# Altium project VENTUNOQ.PrjPcb (part 16 of 18)

## Sheet WIFI_BLE.SchDoc: WIFI BLE
size A3; Author: Silvio Navaretti; CompanyName: ARDUINO; DrawnBy: Silvio Navaretti; Engineer: Silvio Navaretti; Organization: ARDUINO; SheetNumber: 29; SheetTotal: 51; RevAuthor: Silvio Navaretti
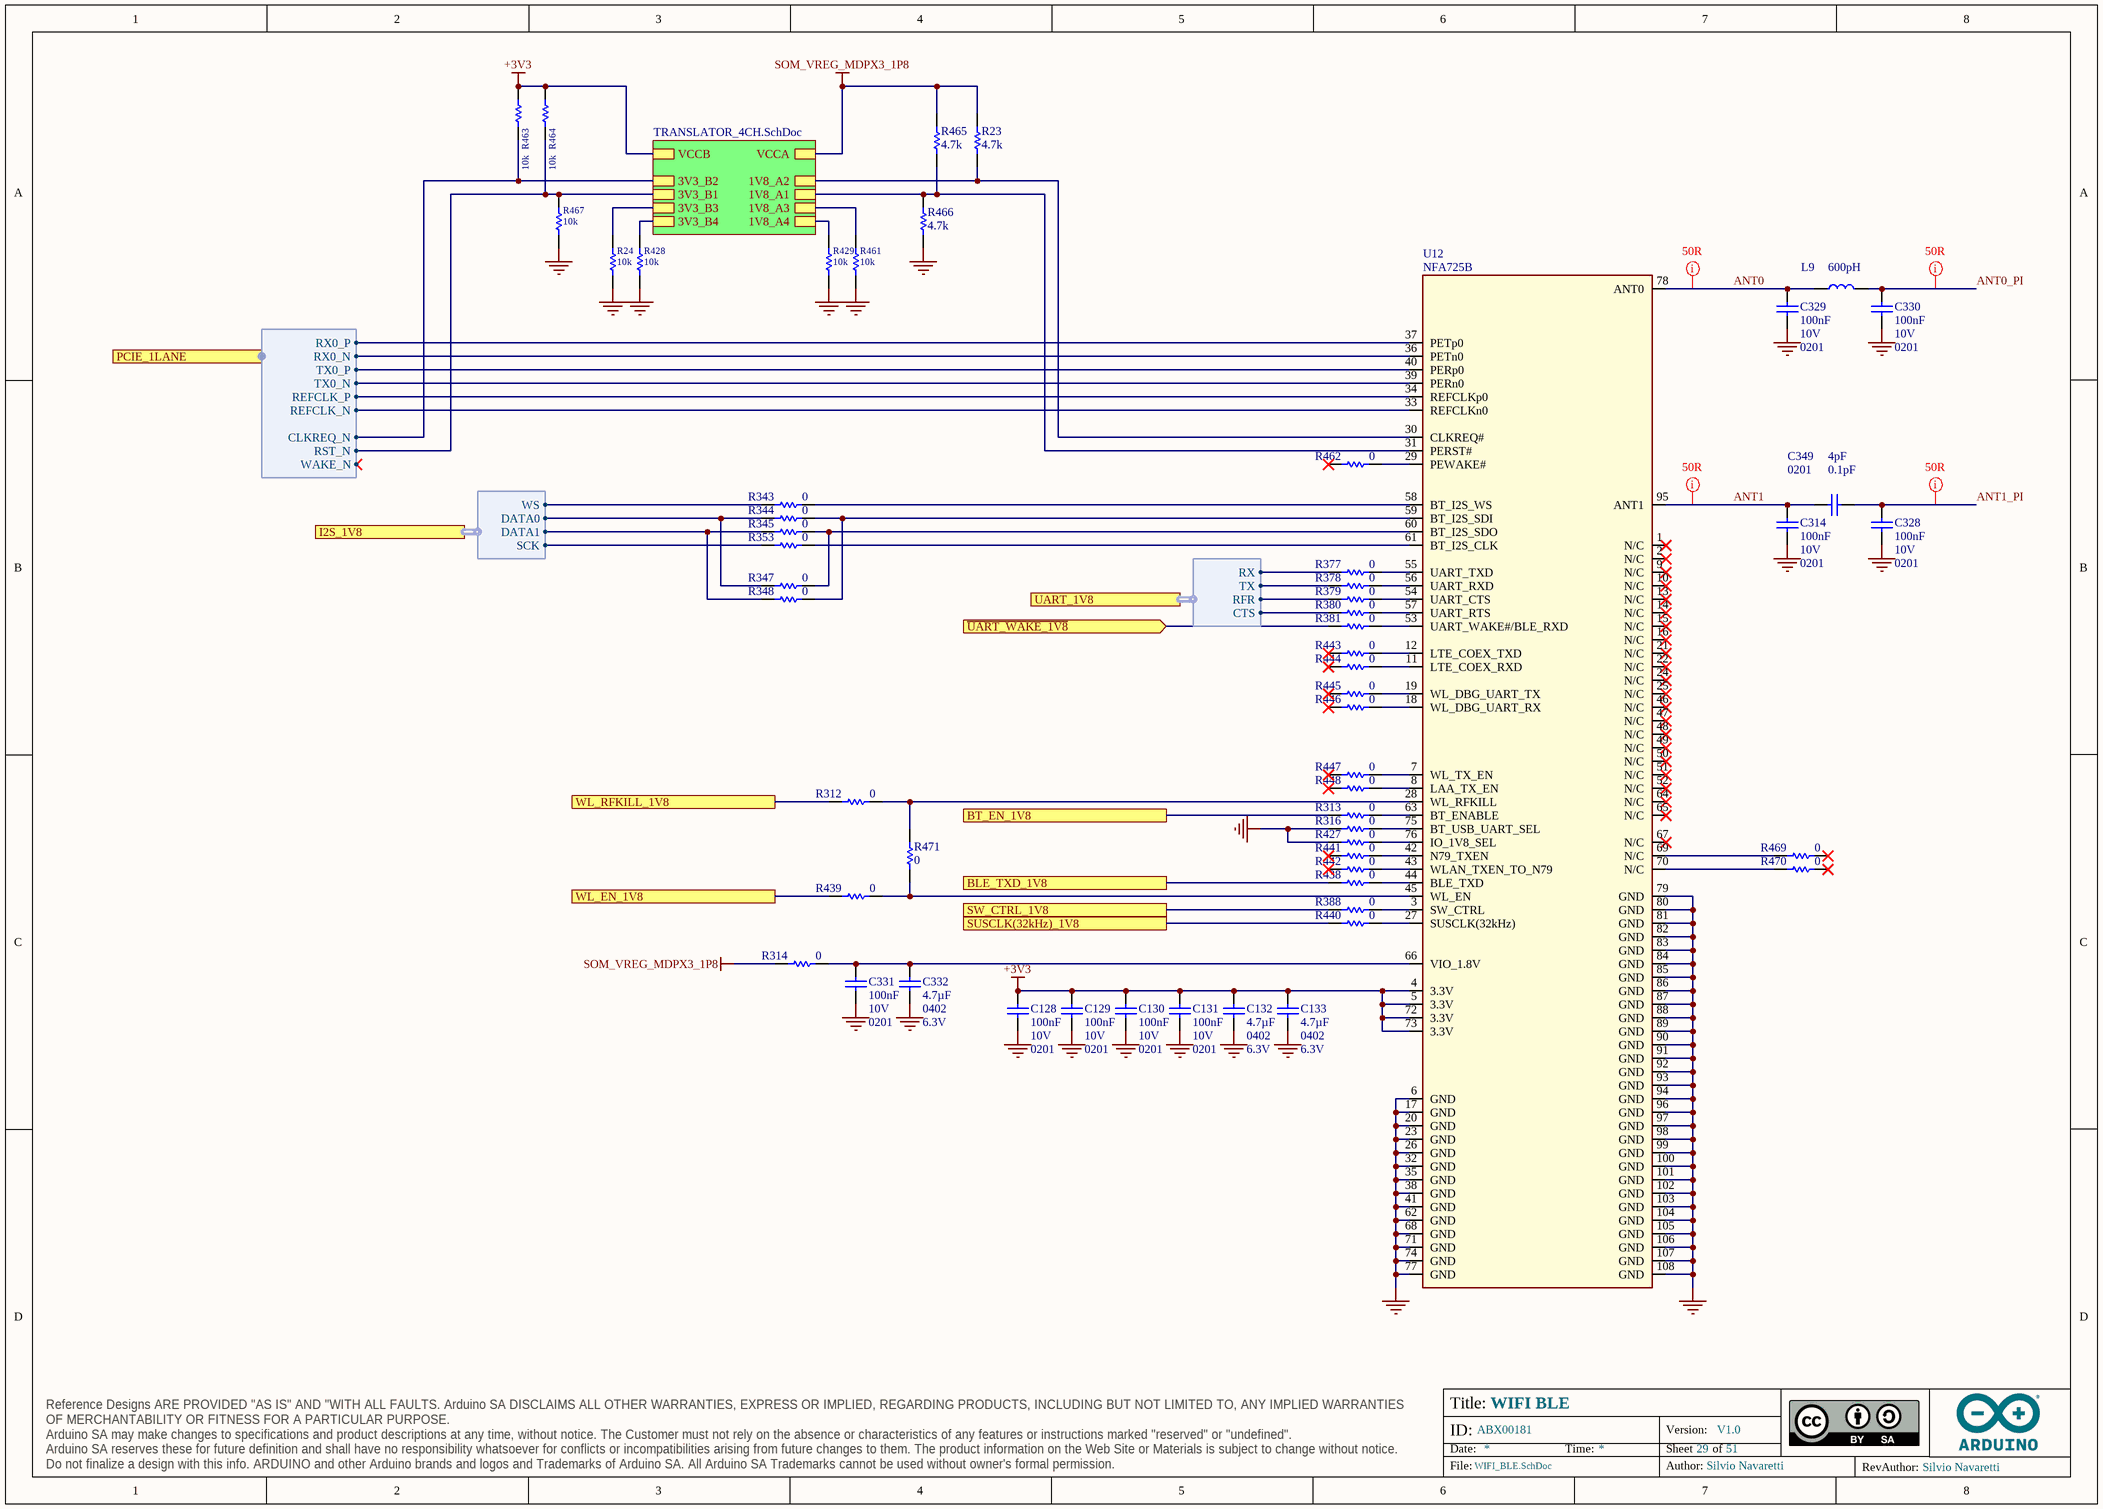
[diagram p49: WIFI_BLE.SchDoc]

### Parts
C128  value 100nF  Voltage: 10V  Case Code (Imperial): 0201  [CAP-0201]  (hidden comment: CL03A104KP3NNNC)
C129  value 100nF  Voltage: 10V  Case Code (Imperial): 0201  [CAP-0201]  (hidden comment: CL03A104KP3NNNC)
C130  value 100nF  Voltage: 10V  Case Code (Imperial): 0201  [CAP-0201]  (hidden comment: CL03A104KP3NNNC)
C131  value 100nF  Voltage: 10V  Case Code (Imperial): 0201  [CAP-0201]  (hidden comment: CL03A104KP3NNNC)
C132  value 4.7µF  Case Code (Imperial): 0402  Voltage: 6.3V  [CAP-0402]  (hidden comment: C1005A475M6R3NT)
C133  value 4.7µF  Case Code (Imperial): 0402  Voltage: 6.3V  [CAP-0402]  (hidden comment: C1005A475M6R3NT)
C314  value 100nF  Voltage: 10V  Case Code (Imperial): 0201  [CAP-0201]  (hidden comment: CL03A104KP3NNNC)
C328  value 100nF  Voltage: 10V  Case Code (Imperial): 0201  [CAP-0201]  (hidden comment: CL03A104KP3NNNC)
C329  value 100nF  Voltage: 10V  Case Code (Imperial): 0201  [CAP-0201]  (hidden comment: CL03A104KP3NNNC)
C330  value 100nF  Voltage: 10V  Case Code (Imperial): 0201  [CAP-0201]  (hidden comment: CL03A104KP3NNNC)
C331  value 100nF  Voltage: 10V  Case Code (Imperial): 0201  [CAP-0201]  (hidden comment: CL03A104KP3NNNC)
C332  value 4.7µF  Case Code (Imperial): 0402  Voltage: 6.3V  [CAP-0402]  (hidden comment: C1005A475M6R3NT)
C349  value 4pF  Case Code (Imperial): 0201  Tolerance: 0.1pF  [CAP-0201]  (hidden comment: GRM0335C1H4R0BA01D)
L9  Inductance: 600pH  [0201DS Coilcraft]  (hidden comment: 0201DS-0N6XKEW)
R23  value 4.7k  [RES-0201]  (hidden comment: RC0201FR-074K7L)
R24  value 10k  [RES-0201]  (hidden comment: RC0201FR-0710KL)
R312  value 0  [RES-0201]  (hidden comment: CRCW02010000Z0ED)
R313  value 0  [RES-0201]  (hidden comment: CRCW02010000Z0ED)
R314  value 0  [RES-0201]  (hidden comment: CRCW02010000Z0ED)
R316  value 0  [RES-0201]  (hidden comment: CRCW02010000Z0ED)
R343  value 0  [RES-0201]  (hidden comment: CRCW02010000Z0ED)
R344  value 0  [RES-0201]  (hidden comment: CRCW02010000Z0ED)
R345  value 0  [RES-0201]  (hidden comment: CRCW02010000Z0ED)
R347  value 0  [RES-0201]  (hidden comment: CRCW02010000Z0ED)
R348  value 0  [RES-0201]  (hidden comment: CRCW02010000Z0ED)
R353  value 0  [RES-0201]  (hidden comment: CRCW02010000Z0ED)
R377  value 0  [RES-0201]  (hidden comment: CRCW02010000Z0ED)
R378  value 0  [RES-0201]  (hidden comment: CRCW02010000Z0ED)
R379  value 0  [RES-0201]  (hidden comment: CRCW02010000Z0ED)
R380  value 0  [RES-0201]  (hidden comment: CRCW02010000Z0ED)
R381  value 0  [RES-0201]  (hidden comment: CRCW02010000Z0ED)
R388  value 0  [RES-0201]  (hidden comment: CRCW02010000Z0ED)
R427  value 0  [RES-0201]  (hidden comment: CRCW02010000Z0ED)
R428  value 10k  [RES-0201]  (hidden comment: RC0201FR-0710KL)
R429  value 10k  [RES-0201]  (hidden comment: RC0201FR-0710KL)
R438  value 0  [RES-0201]  (hidden comment: CRCW02010000Z0ED)
R439  value 0  [RES-0201]  (hidden comment: CRCW02010000Z0ED)
R440  value 0  [RES-0201]  (hidden comment: CRCW02010000Z0ED)
R441  value 0  [RES-0201]  (hidden comment: CRCW02010000Z0ED)
R442  value 0  [RES-0201]  (hidden comment: CRCW02010000Z0ED)
R443  value 0  [RES-0201]  (hidden comment: CRCW02010000Z0ED)
R444  value 0  [RES-0201]  (hidden comment: CRCW02010000Z0ED)
R445  value 0  [RES-0201]  (hidden comment: CRCW02010000Z0ED)
R446  value 0  [RES-0201]  (hidden comment: CRCW02010000Z0ED)
R447  value 0  [RES-0201]  (hidden comment: CRCW02010000Z0ED)
R448  value 0  [RES-0201]  (hidden comment: CRCW02010000Z0ED)
R461  value 10k  [RES-0201]  (hidden comment: RC0201FR-0710KL)
R462  value 0  [RES-0201]  (hidden comment: CRCW02010000Z0ED)
R463  value 10k  [RES-0201]  (hidden comment: RC0201FR-0710KL)
R464  value 10k  [RES-0201]  (hidden comment: RC0201FR-0710KL)
R465  value 4.7k  [RES-0201]  (hidden comment: RC0201FR-074K7L)
R466  value 4.7k  [RES-0201]  (hidden comment: RC0201FR-074K7L)
R467  value 10k  [RES-0201]  (hidden comment: RC0201FR-0710KL)
R469  value 0  [RES-0201]  (hidden comment: CRCW02010000Z0ED)
R470  value 0  [RES-0201]  (hidden comment: CRCW02010000Z0ED)
R471  value 0  [RES-0201]  (hidden comment: CRCW02010000Z0ED)
U12  NFA725B  [NFA725B]

### Sub-sheets
U_TRANSLATOR_4CH = TRANSLATOR_4CH.SchDoc: 1V8_A1, 1V8_A2, 1V8_A3, 1V8_A4, 3V3_B1, 3V3_B2, 3V3_B3, 3V3_B4, VCCA, VCCB

### Ports
BLE_TXD_1V8, BT_EN_1V8, I2S_1V8 (harness SOM_MD_I2S), PCIE_1LANE (harness PCIE_1LANE), SUSCLK(32kHz)_1V8, SW_CTRL_1V8, UART_1V8 (harness SOM_MD_UART_FLCRTL), WL_EN_1V8, WL_RFKILL_1V8, ~{UART_WAKE_1V8} (in)

### Harnesses
SOM_MD_I2S: SCK, WS, DATA0, DATA1
SOM_MD_UART_FLCRTL: TX, CTS, RFR, RX
PCIE_1LANE: RX0_N, RX0_P, TX0_P, TX0_N, REFCLK_N, REFCLK_P, WAKE_N, CLKREQ_N, RST_N

### Nets
+3V3: C128.2 C129.2 C130.2 C131.2 C132.1 C133.1 R463.1 R464.1 U12.4(3.3V) U12.5(3.3V) U12.72(3.3V) U12.73(3.3V) ; sheet U_TRANSLATOR_4CH/VCCB
GND: C128.1 C129.1 C130.1 C131.1 C132.2 C133.2 C314.1 C328.1 C329.1 C330.1 C331.1 C332.2 R24.1 R316.1 R427.1 R428.1 R429.1 R461.1 R466.1 R467.1 U12.6(GND) U12.17(GND) U12.20(GND) U12.23(GND) U12.26(GND) U12.32(GND) U12.35(GND) U12.38(GND) U12.41(GND) U12.62(GND) U12.68(GND) U12.71(GND) U12.74(GND) U12.77(GND) U12.79(GND) U12.80(GND) U12.81(GND) U12.82(GND) U12.83(GND) U12.84(GND) U12.85(GND) U12.86(GND) U12.87(GND) U12.88(GND) U12.89(GND) U12.90(GND) U12.91(GND) U12.92(GND) U12.93(GND) U12.94(GND) U12.96(GND) U12.97(GND) U12.98(GND) U12.99(GND) U12.100(GND) U12.101(GND) U12.102(GND) U12.103(GND) U12.104(GND) U12.105(GND) U12.106(GND) U12.107(GND) U12.108(GND)
SOM_VREG_MDPX3_1P8: R23.2 R314.1 R465.2 ; sheet U_TRANSLATOR_4CH/VCCA
ANT0: C329.2 L9.1 U12.78(ANT0)  [project net ANT0_29]
ANT0_PI: C330.2 L9.2  [project net ANT0_PI_29]
ANT1: C314.2 C349.2 U12.95(ANT1)  [project net ANT1_29]
ANT1_PI: C328.2 C349.1  [project net ANT1_PI_29]
CTS_1V8: R380.1 ; port UART_1V8.CTS
MD_GPIO_54: R312.1 ; port WL_RFKILL_1V8
MD_GPIO_55: R313.1 ; port BT_EN_1V8
MD_GPIO_56: R439.1 ; port WL_EN_1V8
MD_GPIO_65: R381.1 ; port ~{UART_WAKE_1V8}
MD_GPIO_85: R379.1 ; port UART_1V8.RFR
MD_GPIO_86: R378.1 ; port UART_1V8.TX
MD_GPIO_87: R377.1 ; port UART_1V8.RX
MD_GPIO_100: R388.1 ; port SW_CTRL_1V8
MD_GPIO_101: R438.1 ; port BLE_TXD_1V8
MD_LPASS_GPIO_129: R353.1 ; port I2S_1V8.SCK
MD_LPASS_GPIO_130: R343.1 ; port I2S_1V8.WS
MD_LPASS_GPIO_131: R344.1 R347.1 ; port I2S_1V8.DATA0
MD_LPASS_GPIO_132: R345.1 R348.1 ; port I2S_1V8.DATA1
PCIE1_REFCLK0_N: U12.33(REFCLKn0) ; port PCIE_1LANE.REFCLK_N
PCIE1_REFCLK0_P: U12.34(REFCLKp0) ; port PCIE_1LANE.REFCLK_P
PCIE1_RX0_N: U12.36(PETn0) ; port PCIE_1LANE.RX0_N
PCIE1_RX0_P: U12.37(PETp0) ; port PCIE_1LANE.RX0_P
PCIE1_TX0_CAP_N: U12.39(PERn0) ; port PCIE_1LANE.TX0_N
PCIE1_TX0_CAP_P: U12.40(PERp0) ; port PCIE_1LANE.TX0_P
SLEEP_CLK: R440.1 ; port SUSCLK(32kHz)_1V8
NetC331_2: C331.2 C332.1 R314.2 U12.66(VIO_1.8V)
NetR23_1: R23.1 U12.30(CLKREQ#) ; sheet U_TRANSLATOR_4CH/1V8_A2
NetR24_2: R24.2 ; sheet U_TRANSLATOR_4CH/3V3_B3
NetR312_2: R312.2 R471.1 U12.28(WL_RFKILL)
NetR313_2: R313.2 U12.63(BT_ENABLE)
NetR316_2: R316.2 U12.75(BT_USB_UART_SEL)
NetR343_2: R343.2 U12.58(BT_I2S_WS)
NetR344_2: R344.2 R348.2 U12.59(BT_I2S_SDI)
NetR345_2: R345.2 R347.2 U12.60(BT_I2S_SDO)
NetR353_2: R353.2 U12.61(BT_I2S_CLK)
NetR377_2: R377.2 U12.55(UART_TXD)
NetR378_2: R378.2 U12.56(UART_RXD)
NetR379_2: R379.2 U12.54(UART_CTS)
NetR380_2: R380.2 U12.57(UART_RTS)
NetR381_2: R381.2 U12.53(UART_WAKE#/BLE_RXD)
NetR388_2: R388.2 U12.3(SW_CTRL)
NetR427_2: R427.2 U12.76(IO_1V8_SEL)
NetR428_2: R428.2 ; sheet U_TRANSLATOR_4CH/3V3_B4
NetR429_2: R429.2 ; sheet U_TRANSLATOR_4CH/1V8_A4
NetR438_2: R438.2 U12.44(BLE_TXD)
NetR439_2: R439.2 R471.2 U12.45(WL_EN)
NetR440_2: R440.2 U12.27(SUSCLK(32kHz))
NetR441_2: R441.2 U12.42(N79_TXEN)
NetR442_2: R442.2 U12.43(WLAN_TXEN_TO_N79)
NetR443_2: R443.2 U12.12(LTE_COEX_TXD)
NetR444_2: R444.2 U12.11(LTE_COEX_RXD)
NetR445_2: R445.2 U12.19(WL_DBG_UART_TX)
NetR446_2: R446.2 U12.18(WL_DBG_UART_RX)
NetR447_2: R447.2 U12.7(WL_TX_EN)
NetR448_2: R448.2 U12.8(LAA_TX_EN)
NetR461_2: R461.2 ; sheet U_TRANSLATOR_4CH/1V8_A3
NetR462_2: R462.2 U12.29(PEWAKE#)
NetR463_2: R463.2 ; sheet U_TRANSLATOR_4CH/3V3_B2, port PCIE_1LANE.CLKREQ_N
NetR464_2: R464.2 R467.2 ; sheet U_TRANSLATOR_4CH/3V3_B1, port PCIE_1LANE.RST_N
NetR465_1: R465.1 R466.2 U12.31(PERST#) ; sheet U_TRANSLATOR_4CH/1V8_A1
NetR469_1: R469.1 U12.69(N/C)
NetR470_1: R470.1 U12.70(N/C)

Not connected (* = marked no-connect by the designer): R441 1*; R442 1*; R443 1*; R444 1*; R445 1*; R446 1*; R447 1*; R448 1*; R462 1*; R469 2*; R470 2*; U12 1(N/C)* 2(N/C)* 9(N/C)* 10(N/C)* 13(N/C)* 14(N/C)* 15(N/C)* 16(N/C)* 21(N/C)* 22(N/C)* 24(N/C)* 25(N/C)* 46(N/C)* 47(N/C)* 48(N/C)* 49(N/C)* 50(N/C)* 51(N/C)* 52(N/C)* 64(N/C)* 65(N/C)* 67(N/C)*

### Layout directives
net class 50R: ANT0_29, ANT0_PI_29, ANT1_29, ANT1_PI_29

### Notes on the sheet
- Title:
- ID:
- Date:
- Time:
- Version:
- Sheet
- of
- RevAuthor:
- Reference Designs ARE PROVIDED "AS IS" AND "WITH ALL FAULTS. Arduino SA DISCLAIMS ALL OTHER WARRANTIES, EXPRESS OR IMPLIED, REGARDING PRODUCTS, INCLUDING BUT NOT LIMITED TO, ANY IMPLIED WARRANTIES OF MERCHANTABILITY OR FITNESS FOR A PARTICULAR PURPOSE.
  Arduino SA may make changes to specifications and product descriptions at any time, without notice. The Customer must not rely on the absence or characteristics of any features or instructions marked "reserved" or "undefined".
  Arduino SA reserves these for future definition and shall have no responsibility whatsoever for conflicts or incompatibilities arising from future changes to them. The product information on the Web Site or Materials is subject to change without notice.
  Do not finalize a design with this info. ARDUINO and other Arduino brands and logos and Trademarks of Arduino SA. All Arduino SA Trademarks cannot be used without owner's formal permission.
- File:
- Author:

### Library data of the parts
C128-C131 C314 C328-C331 = C0113-A.6: CAP CHIP 0201 100nF 10% 10V X5R; Manufacturer: Samsung Electro-Mechanics; Code Arduino: C0113; Technology: Ceramic; Part Number: CL03A104KP3NNNC; Dielectric: X5R; Tolerance: 10%
C132 C133 C332 = C0037-A.14: CAP CHIP 0402 4.7uF 20% 6V3 X5R; Manufacturer: Hottech; Code Arduino: 0833; Dielectric: X5R; Technology: Ceramic; Part Number: C1005A475M6R3NT; Manufacturer 2: Samsung Electro-Mechanics; Tolerance: 20%; Manufacturer 3: Murata Electronics; Part number 3: GRM155R60J475ME47D; Part number 2: CL05A475KQ5NRNC
C349 = C0210-A.1: CAP CHIP 0201 4pF 0.1pF 50V C0G; Manufacturer: Murata; Code Arduino: C0210; Technology: Ceramic; Part Number: GRM0335C1H4R0BA01D; Voltage: 50V; Dielectric: C0G
L9 = I0132-A.2: IND 0201 0.6nH 1A 30mR; Code Arduino: I0132; DCR max: 30m; Part Number: 0201DS-0N6XKEW
R23 R465 R466 = R0151-A.21: RES CHIP 0201 4k7 1% 1/20W; Manufacturer: Yageo; Power: 50mW; Temperature coefficient: 200ppm; Code Arduino: A5521; Tolerance: 1%; Case Code (Imperial): 0201; Part Number: RC0201FR-074K7L; Technology: Thick film
R24 R428 R429 R461 R463 R464 R467 = R0145-A.21: RES CHIP 0201 10k 1% 1/20W; Manufacturer: Yageo; Power: 50mW; Temperature coefficient: 200ppm; Code Arduino: R0145; Manufacturer 2: Samsung Electro-Mechanics; Tolerance: 1%; Case Code (Imperial): 0201; Part Number: RC0201FR-0710KL; Technology: Thick film
R312-R314 R316 R343-R345 R347 R348 R353 R377-R381 R388 R427 R438-R448 R462 R469-R471 = R0140-A.21: RES CHIP 0201 0R; Manufacturer: Vishay; Temperature coefficient: 0ppm; Code Arduino: R0140; Power: 50mW; Tolerance: 0%; Technology: Thick film; Case Code (Imperial): 0201; Part Number: CRCW02010000Z0ED
U12 = M0030-A.15: Module 802.11a/b/g/n/ac/ax 2x2 MAC + BT 5.2, QCA2066, with 2 antenna pads, PCIe, LGA76 14x17.68mm; Manufacturer: USI; Code Arduino: M0030; Part Number: NFA725B

## Sheet PCIE_USB.SchDoc: PCIE_USB
size A3; Author: Silvio Navaretti; CompanyName: ARDUINO; DrawnBy: Silvio Navaretti; Engineer: Silvio Navaretti; Organization: ARDUINO; SheetNumber: 26; SheetTotal: 51; RevAuthor: Silvio Navaretti
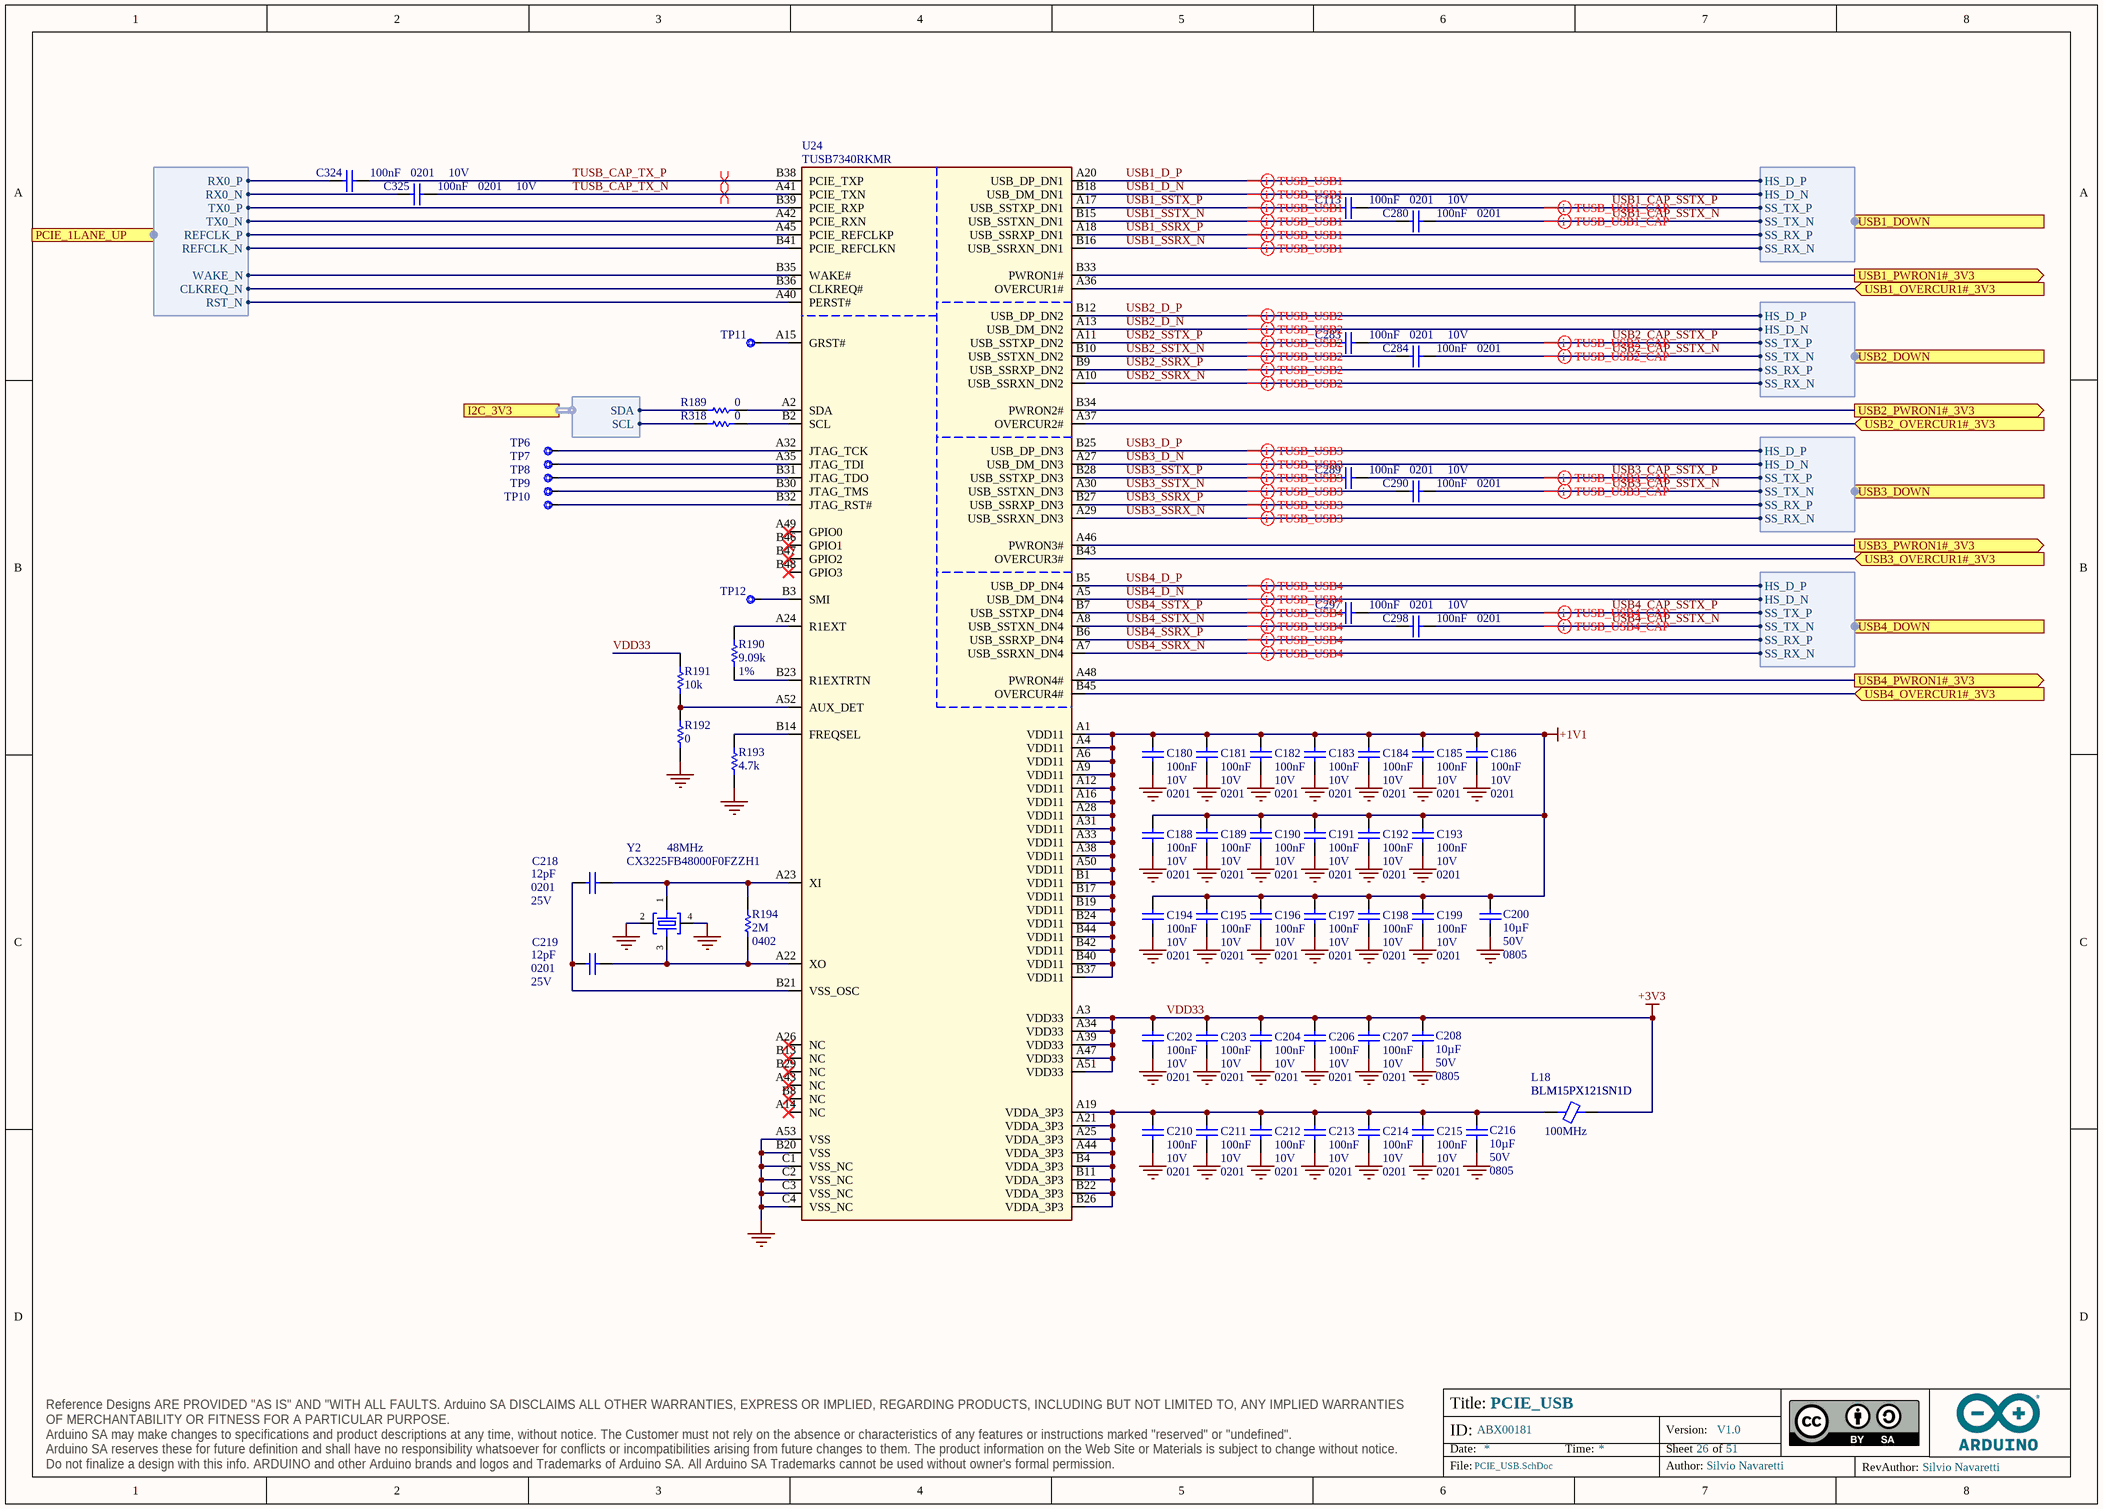
[diagram p50: PCIE_USB.SchDoc]

### Parts
C113  value 100nF  Case Code (Imperial): 0201  Voltage: 10V  [CAP-0201]  (hidden comment: CL03A104KP3NNNC)
C180  value 100nF  Voltage: 10V  Case Code (Imperial): 0201  [CAP-0201]  (hidden comment: CL03A104KP3NNNC)
C181  value 100nF  Voltage: 10V  Case Code (Imperial): 0201  [CAP-0201]  (hidden comment: CL03A104KP3NNNC)
C182  value 100nF  Voltage: 10V  Case Code (Imperial): 0201  [CAP-0201]  (hidden comment: CL03A104KP3NNNC)
C183  value 100nF  Voltage: 10V  Case Code (Imperial): 0201  [CAP-0201]  (hidden comment: CL03A104KP3NNNC)
C184  value 100nF  Voltage: 10V  Case Code (Imperial): 0201  [CAP-0201]  (hidden comment: CL03A104KP3NNNC)
C185  value 100nF  Voltage: 10V  Case Code (Imperial): 0201  [CAP-0201]  (hidden comment: CL03A104KP3NNNC)
C186  value 100nF  Voltage: 10V  Case Code (Imperial): 0201  [CAP-0201]  (hidden comment: CL03A104KP3NNNC)
C188  value 100nF  Voltage: 10V  Case Code (Imperial): 0201  [CAP-0201]  (hidden comment: CL03A104KP3NNNC)
C189  value 100nF  Voltage: 10V  Case Code (Imperial): 0201  [CAP-0201]  (hidden comment: CL03A104KP3NNNC)
C190  value 100nF  Voltage: 10V  Case Code (Imperial): 0201  [CAP-0201]  (hidden comment: CL03A104KP3NNNC)
C191  value 100nF  Voltage: 10V  Case Code (Imperial): 0201  [CAP-0201]  (hidden comment: CL03A104KP3NNNC)
C192  value 100nF  Voltage: 10V  Case Code (Imperial): 0201  [CAP-0201]  (hidden comment: CL03A104KP3NNNC)
C193  value 100nF  Voltage: 10V  Case Code (Imperial): 0201  [CAP-0201]  (hidden comment: CL03A104KP3NNNC)
C194  value 100nF  Voltage: 10V  Case Code (Imperial): 0201  [CAP-0201]  (hidden comment: CL03A104KP3NNNC)
C195  value 100nF  Voltage: 10V  Case Code (Imperial): 0201  [CAP-0201]  (hidden comment: CL03A104KP3NNNC)
C196  value 100nF  Voltage: 10V  Case Code (Imperial): 0201  [CAP-0201]  (hidden comment: CL03A104KP3NNNC)
C197  value 100nF  Voltage: 10V  Case Code (Imperial): 0201  [CAP-0201]  (hidden comment: CL03A104KP3NNNC)
C198  value 100nF  Voltage: 10V  Case Code (Imperial): 0201  [CAP-0201]  (hidden comment: CL03A104KP3NNNC)
C199  value 100nF  Voltage: 10V  Case Code (Imperial): 0201  [CAP-0201]  (hidden comment: CL03A104KP3NNNC)
C200  value 10µF  Voltage: 50V  Case Code (Imperial): 0805  [CAP-0805]  (hidden comment: GRM21BR61H106ME43L)
C202  value 100nF  Voltage: 10V  Case Code (Imperial): 0201  [CAP-0201]  (hidden comment: CL03A104KP3NNNC)
C203  value 100nF  Voltage: 10V  Case Code (Imperial): 0201  [CAP-0201]  (hidden comment: CL03A104KP3NNNC)
C204  value 100nF  Voltage: 10V  Case Code (Imperial): 0201  [CAP-0201]  (hidden comment: CL03A104KP3NNNC)
C206  value 100nF  Voltage: 10V  Case Code (Imperial): 0201  [CAP-0201]  (hidden comment: CL03A104KP3NNNC)
C207  value 100nF  Voltage: 10V  Case Code (Imperial): 0201  [CAP-0201]  (hidden comment: CL03A104KP3NNNC)
C208  value 10µF  Voltage: 50V  Case Code (Imperial): 0805  [CAP-0805]  (hidden comment: GRM21BR61H106ME43L)
C210  value 100nF  Voltage: 10V  Case Code (Imperial): 0201  [CAP-0201]  (hidden comment: CL03A104KP3NNNC)
C211  value 100nF  Voltage: 10V  Case Code (Imperial): 0201  [CAP-0201]  (hidden comment: CL03A104KP3NNNC)
C212  value 100nF  Voltage: 10V  Case Code (Imperial): 0201  [CAP-0201]  (hidden comment: CL03A104KP3NNNC)
C213  value 100nF  Voltage: 10V  Case Code (Imperial): 0201  [CAP-0201]  (hidden comment: CL03A104KP3NNNC)
C214  value 100nF  Voltage: 10V  Case Code (Imperial): 0201  [CAP-0201]  (hidden comment: CL03A104KP3NNNC)
C215  value 100nF  Voltage: 10V  Case Code (Imperial): 0201  [CAP-0201]  (hidden comment: CL03A104KP3NNNC)
C216  value 10µF  Voltage: 50V  Case Code (Imperial): 0805  [CAP-0805]  (hidden comment: GRM21BR61H106ME43L)
C218  value 12pF  Case Code (Imperial): 0201  Voltage: 25V  [CAP-0201]  (hidden comment: GRM0335C1E120JA01J)
C219  value 12pF  Case Code (Imperial): 0201  Voltage: 25V  [CAP-0201]  (hidden comment: GRM0335C1E120JA01J)
C280  value 100nF  Case Code (Imperial): 0201  [CAP-0201]  (hidden comment: CL03A104KP3NNNC)
C283  value 100nF  Case Code (Imperial): 0201  Voltage: 10V  [CAP-0201]  (hidden comment: CL03A104KP3NNNC)
C284  value 100nF  Case Code (Imperial): 0201  [CAP-0201]  (hidden comment: CL03A104KP3NNNC)
C289  value 100nF  Case Code (Imperial): 0201  Voltage: 10V  [CAP-0201]  (hidden comment: CL03A104KP3NNNC)
C290  value 100nF  Case Code (Imperial): 0201  [CAP-0201]  (hidden comment: CL03A104KP3NNNC)
C297  value 100nF  Case Code (Imperial): 0201  Voltage: 10V  [CAP-0201]  (hidden comment: CL03A104KP3NNNC)
C298  value 100nF  Case Code (Imperial): 0201  [CAP-0201]  (hidden comment: CL03A104KP3NNNC)
C324  value 100nF  Case Code (Imperial): 0201  Voltage: 10V  [CAP-0201]  (hidden comment: CL03A104KP3NNNC)
C325  value 100nF  Case Code (Imperial): 0201  Voltage: 10V  [CAP-0201]  (hidden comment: CL03A104KP3NNNC)
L18  BLM15PX121SN1D  Test Frequency: 100MHz  [L-0402]
R189  value 0  [RES-0201]  (hidden comment: CRCW02010000Z0ED)
R190  value 9.09k  Tolerance: 1%  [RES-0201]  (hidden comment: RC0201FR-079K09L)
R191  value 10k  [RES-0201]  (hidden comment: RC0201FR-0710KL)
R192  value 0  [RES-0201]  (hidden comment: CRCW02010000Z0ED)
R193  value 4.7k  [RES-0201]  (hidden comment: RC0201FR-074K7L)
R194  value 2M  Case Code (Imperial): 0402  [RES-0402]  (hidden comment: RC0402FR-072ML)
R318  value 0  [RES-0201]  (hidden comment: CRCW02010000Z0ED)
TP6  Test point 1.00mm  [TP-1.00MM]  (value not drawn)  (no BOM)
TP7  Test point 1.00mm  [TP-1.00MM]  (value not drawn)  (no BOM)
TP8  Test point 1.00mm  [TP-1.00MM]  (value not drawn)  (no BOM)
TP9  Test point 1.00mm  [TP-1.00MM]  (value not drawn)  (no BOM)
TP10  Test point 1.00mm  [TP-1.00MM]  (value not drawn)  (no BOM)
TP11  Test point 1.00mm  [TP-1.00MM]  (value not drawn)  (no BOM)
TP12  Test point 1.00mm  [TP-1.00MM]  (value not drawn)  (no BOM)
U24  TUSB7340RKMR  [TI RKM S-PWQFN-N100 Double row 9x9mm pitch 0.6mm]
Y2  CX3225FB48000F0FZZH1  Frequency: 48MHz  [CRYSTAL3.2X2.5]

### Ports
I2C_3V3 (harness I2C), PCIE_1LANE_UP (harness PCIE_1LANE), USB1_DOWN (harness SOM_MD_USB0), USB1_OVERCUR1#_3V3 (in), USB1_PWRON1#_3V3 (out), USB2_DOWN (harness SOM_MD_USB0), USB2_OVERCUR1#_3V3 (in), USB2_PWRON1#_3V3 (out), USB3_DOWN (harness SOM_MD_USB0), USB3_OVERCUR1#_3V3 (in), USB3_PWRON1#_3V3 (out), USB4_DOWN (harness SOM_MD_USB0), USB4_OVERCUR1#_3V3 (in), USB4_PWRON1#_3V3 (out)

### Harnesses
SOM_MD_USB0: SS_TX_N, SS_TX_P, HS_D_P, HS_D_N, SS_RX_P, SS_RX_N
PCIE_1LANE: RX0_N, RX0_P, TX0_P, TX0_N, REFCLK_N, REFCLK_P, WAKE_N, CLKREQ_N, RST_N
I2C: SDA, SCL

### Nets
+1V1: C180.2 C181.2 C182.2 C183.2 C184.2 C185.2 C186.2 C188.2 C189.2 C190.2 C191.2 C192.2 C193.2 C194.2 C195.2 C196.2 C197.2 C198.2 C199.2 C200.2 U24.A1(VDD11) U24.A4(VDD11) U24.A6(VDD11) U24.A9(VDD11) U24.A12(VDD11) U24.A16(VDD11) U24.A28(VDD11) U24.A31(VDD11) U24.A33(VDD11) U24.A38(VDD11) U24.A50(VDD11) U24.B1(VDD11) U24.B17(VDD11) U24.B19(VDD11) U24.B24(VDD11) U24.B37(VDD11) U24.B40(VDD11) U24.B42(VDD11) U24.B44(VDD11)
+3V3: C202.2 C203.2 C204.2 C206.2 C207.2 C208.2 L18.2 R191.2 U24.A3(VDD33) U24.A34(VDD33) U24.A39(VDD33) U24.A47(VDD33) U24.A51(VDD33)  [also labelled VDD33]
GND: C180.1 C181.1 C182.1 C183.1 C184.1 C185.1 C186.1 C188.1 C189.1 C190.1 C191.1 C192.1 C193.1 C194.1 C195.1 C196.1 C197.1 C198.1 C199.1 C200.1 C202.1 C203.1 C204.1 C206.1 C207.1 C208.1 C210.1 C211.1 C212.1 C213.1 C214.1 C215.1 C216.1 R192.2 R193.2 U24.A53(VSS) U24.B20(VSS) U24.C1(VSS_NC) U24.C2(VSS_NC) U24.C3(VSS_NC) U24.C4(VSS_NC) Y2.2 Y2.4
MD_QUP1_SE4_I2C_3V3.SCL: R318.1 ; port I2C_3V3.SCL
MD_QUP1_SE4_I2C_3V3.SDA: R189.1 ; port I2C_3V3.SDA
PCIE2_REFCLK0_N: U24.B41(PCIE_REFCLKN) ; port PCIE_1LANE_UP.REFCLK_N
PCIE2_REFCLK0_P: U24.A45(PCIE_REFCLKP) ; port PCIE_1LANE_UP.REFCLK_P
PCIE2_RX0_N: C325.1 ; port PCIE_1LANE_UP.RX0_N
PCIE2_RX0_P: C324.1 ; port PCIE_1LANE_UP.RX0_P
PCIE2_TX0_CAP_N: U24.A42(PCIE_RXN) ; port PCIE_1LANE_UP.TX0_N
PCIE2_TX0_CAP_P: U24.B39(PCIE_RXP) ; port PCIE_1LANE_UP.TX0_P
TUSB_CAP_TX_N: C325.2 U24.A41(PCIE_TXN)  [project net TUSB_CAP_TX_N_26]
TUSB_CAP_TX_P: C324.2 U24.B38(PCIE_TXP)  [project net TUSB_CAP_TX_P_26]
USB1_CAP_SSTX_N: C280.2 ; port USB1_DOWN.SS_TX_N
USB1_CAP_SSTX_P: C113.2 ; port USB1_DOWN.SS_TX_P
USB1_D_N: U24.B18(USB_DM_DN1) ; port USB1_DOWN.HS_D_N
USB1_D_P: U24.A20(USB_DP_DN1) ; port USB1_DOWN.HS_D_P
USB1_SSRX_N: U24.B16(USB_SSRXN_DN1) ; port USB1_DOWN.SS_RX_N
USB1_SSRX_P: U24.A18(USB_SSRXP_DN1) ; port USB1_DOWN.SS_RX_P
USB1_SSTX_N: C280.1 U24.B15(USB_SSTXN_DN1)  [project net USB1_SSTX_N_26]
USB1_SSTX_P: C113.1 U24.A17(USB_SSTXP_DN1)  [project net USB1_SSTX_P_26]
USB2_CAP_SSTX_N: C284.2 ; port USB2_DOWN.SS_TX_N
USB2_CAP_SSTX_P: C283.2 ; port USB2_DOWN.SS_TX_P
USB2_D_N: U24.A13(USB_DM_DN2) ; port USB2_DOWN.HS_D_N
USB2_D_P: U24.B12(USB_DP_DN2) ; port USB2_DOWN.HS_D_P
USB2_SSRX_N: U24.A10(USB_SSRXN_DN2) ; port USB2_DOWN.SS_RX_N
USB2_SSRX_P: U24.B9(USB_SSRXP_DN2) ; port USB2_DOWN.SS_RX_P
USB2_SSTX_N: C284.1 U24.B10(USB_SSTXN_DN2)  [project net USB2_SSTX_N_26]
USB2_SSTX_P: C283.1 U24.A11(USB_SSTXP_DN2)  [project net USB2_SSTX_P_26]
USB3_CAP_SSTX_N: C290.2 ; port USB3_DOWN.SS_TX_N
USB3_CAP_SSTX_P: C289.2 ; port USB3_DOWN.SS_TX_P
USB3_D_N: U24.A27(USB_DM_DN3) ; port USB3_DOWN.HS_D_N
USB3_D_P: U24.B25(USB_DP_DN3) ; port USB3_DOWN.HS_D_P
USB3_SSRX_N: U24.A29(USB_SSRXN_DN3) ; port USB3_DOWN.SS_RX_N
USB3_SSRX_P: U24.B27(USB_SSRXP_DN3) ; port USB3_DOWN.SS_RX_P
USB3_SSTX_N: C290.1 U24.A30(USB_SSTXN_DN3)  [project net USB3_SSTX_N_26]
USB3_SSTX_P: C289.1 U24.B28(USB_SSTXP_DN3)  [project net USB3_SSTX_P_26]
USB4_CAP_SSTX_N: C298.2 ; port USB4_DOWN.SS_TX_N
USB4_CAP_SSTX_P: C297.2 ; port USB4_DOWN.SS_TX_P
USB4_D_N: U24.A5(USB_DM_DN4) ; port USB4_DOWN.HS_D_N
USB4_D_P: U24.B5(USB_DP_DN4) ; port USB4_DOWN.HS_D_P
USB4_SSRX_N: U24.A7(USB_SSRXN_DN4) ; port USB4_DOWN.SS_RX_N
USB4_SSRX_P: U24.B6(USB_SSRXP_DN4) ; port USB4_DOWN.SS_RX_P
USB4_SSTX_N: C298.1 U24.A8(USB_SSTXN_DN4)  [project net USB4_SSTX_N_26]
USB4_SSTX_P: C297.1 U24.B7(USB_SSTXP_DN4)  [project net USB4_SSTX_P_26]
NetC210_2: C210.2 C211.2 C212.2 C213.2 C214.2 C215.2 C216.2 L18.1 U24.A19(VDDA_3P3) U24.A21(VDDA_3P3) U24.A25(VDDA_3P3) U24.A44(VDDA_3P3) U24.B4(VDDA_3P3) U24.B11(VDDA_3P3) U24.B22(VDDA_3P3) U24.B26(VDDA_3P3)
NetC218_1: C218.1 R194.2 U24.A23(XI) Y2.1
NetC218_2: C218.2 C219.2 U24.B21(VSS_OSC)
NetC219_1: C219.1 R194.1 U24.A22(XO) Y2.3
NetJOMEGA_54: U24.B33(PWRON1#) ; port USB1_PWRON1#_3V3
NetJOMEGA_56: U24.A36(OVERCUR1#) ; port USB1_OVERCUR1#_3V3
NetJOMEGA_58: U24.A46(PWRON3#) ; port USB3_PWRON1#_3V3
NetJOMEGA_60: U24.B43(OVERCUR3#) ; port USB3_OVERCUR1#_3V3
NetR154_2: U24.A48(PWRON4#) ; port USB4_PWRON1#_3V3
NetR182_2: U24.B34(PWRON2#) ; port USB2_PWRON1#_3V3
NetR189_2: R189.2 U24.A2(SDA)
NetR190_1: R190.1 U24.A24(R1EXT)
NetR190_2: R190.2 U24.B23(R1EXTRTN)
NetR191_1: R191.1 R192.1 U24.A52(AUX_DET)
NetR193_1: R193.1 U24.B14(FREQSEL)
NetR318_2: R318.2 U24.B2(SCL)
NetTP6_X: TP6.X U24.A32(JTAG_TCK)
NetTP7_X: TP7.X U24.A35(JTAG_TDI)
NetTP8_X: TP8.X U24.B31(JTAG_TDO)
NetTP9_X: TP9.X U24.B30(JTAG_TMS)
NetTP10_X: TP10.X U24.B32(JTAG_RST#)
NetTP11_X: TP11.X U24.A15(GRST#)
NetTP12_X: TP12.X U24.B3(SMI)
NetU24_A37: U24.A37(OVERCUR2#) ; port USB2_OVERCUR1#_3V3
NetU24_A40: U24.A40(PERST#) ; port PCIE_1LANE_UP.RST_N
NetU24_B35: U24.B35(WAKE#) ; port PCIE_1LANE_UP.WAKE_N
NetU24_B36: U24.B36(CLKREQ#) ; port PCIE_1LANE_UP.CLKREQ_N
NetU24_B45: U24.B45(OVERCUR4#) ; port USB4_OVERCUR1#_3V3

Not connected (* = marked no-connect by the designer): U24 A14(NC)* A26(NC)* A43(NC)* A49(GPIO0)* B8(NC)* B13(NC)* B29(NC)* B46(GPIO1)* B47(GPIO2)* B48(GPIO3)*

### Layout directives
differential pair; differential pair class PCIE_USB_CAPS: TUSB_CAP_TX_N_26, TUSB_CAP_TX_P_26
differential pair; differential pair class TUSB_USB1: USB1_D_N, USB1_D_P, USB1_SSRX_N, USB1_SSRX_P, USB1_SSTX_N_26, USB1_SSTX_P_26
differential pair; differential pair class TUSB_USB2: USB2_D_N, USB2_D_P, USB2_SSRX_N, USB2_SSRX_P, USB2_SSTX_N_26, USB2_SSTX_P_26
differential pair; differential pair class TUSB_USB3: USB3_D_N, USB3_D_P, USB3_SSRX_N, USB3_SSRX_P, USB3_SSTX_N_26, USB3_SSTX_P_26
differential pair; differential pair class TUSB_USB4: USB4_D_N, USB4_D_P, USB4_SSRX_N, USB4_SSRX_P, USB4_SSTX_N_26, USB4_SSTX_P_26
differential pair; differential pair class TUSB_USB1_CAP: USB1_CAP_SSTX_N, USB1_CAP_SSTX_P
differential pair; differential pair class TUSB_USB2_CAP: USB2_CAP_SSTX_N, USB2_CAP_SSTX_P
differential pair; differential pair class TUSB_USB3_CAP: USB3_CAP_SSTX_N, USB3_CAP_SSTX_P
differential pair; differential pair class TUSB_USB4_CAP: USB4_CAP_SSTX_N, USB4_CAP_SSTX_P

### Notes on the sheet
- Title:
- ID:
- Date:
- Time:
- Version:
- Sheet
- of
- RevAuthor:
- Reference Designs ARE PROVIDED "AS IS" AND "WITH ALL FAULTS. Arduino SA DISCLAIMS ALL OTHER WARRANTIES, EXPRESS OR IMPLIED, REGARDING PRODUCTS, INCLUDING BUT NOT LIMITED TO, ANY IMPLIED WARRANTIES OF MERCHANTABILITY OR FITNESS FOR A PARTICULAR PURPOSE.
  Arduino SA may make changes to specifications and product descriptions at any time, without notice. The Customer must not rely on the absence or characteristics of any features or instructions marked "reserved" or "undefined".
  Arduino SA reserves these for future definition and shall have no responsibility whatsoever for conflicts or incompatibilities arising from future changes to them. The product information on the Web Site or Materials is subject to change without notice.
  Do not finalize a design with this info. ARDUINO and other Arduino brands and logos and Trademarks of Arduino SA. All Arduino SA Trademarks cannot be used without owner's formal permission.
- File:
- Author:

### Library data of the parts
C113 C180-C186 C188-C199 C202-C204 C206 C207 C210-C215 C280 C283 C284 C289 C290 C297 C298 C324 C325 = C0113-A.6: as C128-C131 on sheet WIFI_BLE; Technology: Ceramic; Tolerance: 10%; Part Number: CL03A104KP3NNNC; Dielectric: X5R
C200 C208 C216 = C0158-A.3: CAP CHIP 0805 10uF 20% 50V X5R; Manufacturer: Murata Electronics; Code Arduino: C0158; Dielectric: X5R; Technology: SMD; Part Number: GRM21BR61H106ME43L; Tolerance: 20%
C218 C219 = C0003-A.15: CAP CHIP 0201 12pF 5% 25V C0G; Manufacturer: Murata; Code Arduino: C0003; Technology: Ceramic; Part Number: GRM0335C1E120JA01J; Tolerance: 5%; Dielectric: C0G
L18 = I0028-A.10: FERRITE SMD 0402 120Ohm 25% 100MHz Ferrite 2A; Manufacturer: Murata; Inductance: 120µH; DC Resistance (DCR): 55mR; Code Arduino: I0028; Value: 120µH; Part Number: BLM15PX121SN1D; Device Type: Ferrite; Packaging: Tape and Reel; Case Code (Imperial): 0402; Max DC Current: 2A; Case Code (Metric): 1005; Package Quantity: 10000; Current: 2A; Max Operating Temperature: 125°C; Tolerance: 25%; Min Operating Temperature: -55°C
R189 R192 R318 = R0140-A.21: as R312-R314 on sheet WIFI_BLE; Technology: Thick film; Case Code (Imperial): 0201; Part Number: CRCW02010000Z0ED
R190 = R0397-A.2: RES CHIP 0201 9k09 1% 1/20W; Manufacturer: YAGEO; Code Arduino: R0397; Power: 50mW; Temperature Coefficient: 200ppm; Technology: Thick film; Part Number: RC0201FR-079K09L; Case Code (Imperial): 0201
R191 = R0145-A.21: as R24 on sheet WIFI_BLE; Manufacturer 2: Samsung Electro-Mechanics; Tolerance: 1%; Case Code (Imperial): 0201; Part Number: RC0201FR-0710KL; Technology: Thick film
R193 = R0151-A.21: RES CHIP 0201 4k7 1% 1/20W; Manufacturer: Yageo; Temperature coefficient: 200ppm; Power: 50mW; Code Arduino: A5521; Technology: Thick film; Case Code (Imperial): 0201; Part Number: RC0201FR-074K7L; Tolerance: 1%
R194 = R0394-A.1: RES CHIP 0402 2M 1% 1/16W; Manufacturer: YAGEO; Temperature coefficient: 100ppm; Code Arduino: R0394; Power: 62.5mW; Technology: Thick film; Part Number: RC0402FR-072ML; Tolerance: 1%
TP6-TP12 = UT0013-A.6: Part Number: This is not a component; Design Item ID: CMP-018-0005-A.3; Source: ut.SchLib; Manufacturer: This is not a component; Code Arduino: This is not a component; Pin Count: 1
U24 = U0510-A.10: IC PCIe x1 Gen2 to x4 USB 3.0 converter, QFN-MR100 9x9mm; Manufacturer: Texas Instruments; Code Arduino: U0510; Part Number: TUSB7340RKMR
Y2 = X0032-A.3: CRYSTAL 48MHz tolerance 10ppm stability 20ppm load 10pF 3.2x2.5mm; Manufacturer: Kyocera; Series Resistance: 30R; ESR (Equivalent Series Resistance): 30; Code Arduino: X0032; Max Operating Temperature: 85°C; Frequency Tolerance: 10ppm; Load Capacitance: 10pF; Min Operating Temperature: -40°C; Frequency Stability: 20ppm; Part Number: CX3225FB48000F0FZZH1

## Sheet CAN_PHY.SchDoc: CAN PHY
size A3; Author: Silvio Navaretti; CompanyName: ARDUINO; DrawnBy: Silvio Navaretti; Engineer: Silvio Navaretti; Organization: ARDUINO; SheetNumber: 48; SheetTotal: 51; RevAuthor: Silvio Navaretti
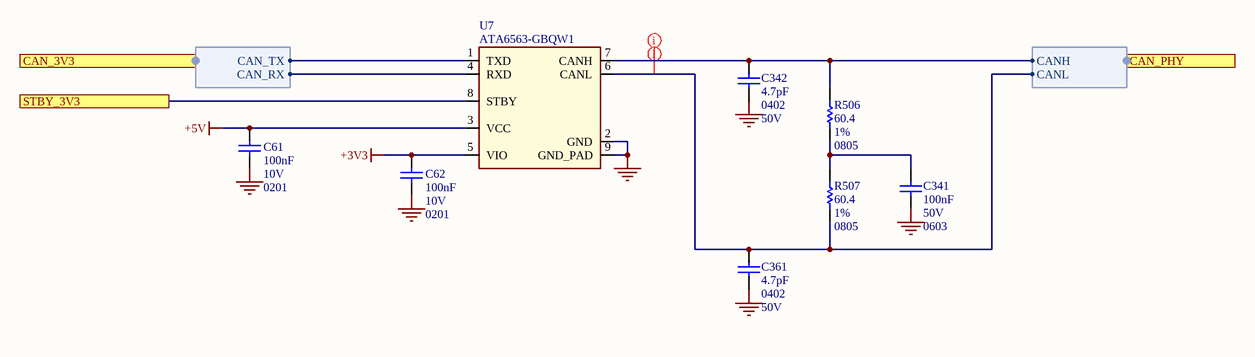
[diagram p51: CAN_PHY.SchDoc]

### Parts
C61  value 100nF  Voltage: 10V  Case Code (Imperial): 0201  [CAP-0201]  (hidden comment: CL03A104KP3NNNC)
C62  value 100nF  Voltage: 10V  Case Code (Imperial): 0201  [CAP-0201]  (hidden comment: CL03A104KP3NNNC)
C341  value 100nF  Voltage: 50V  Case Code (Imperial): 0603  [CAP-0603]  (hidden comment: 0603B104K500CT)
C342  value 4.7pF  Case Code (Imperial): 0402  Voltage: 50V  [CAP-0402]  (hidden comment: 04025A4R7DAT2A)
C361  value 4.7pF  Case Code (Imperial): 0402  Voltage: 50V  [CAP-0402]  (hidden comment: 04025A4R7DAT2A)
R506  value 60.4  Tolerance: 1%  Case Code (Imperial): 0805  [RES-0805]  (hidden comment: RT0805FRE0760R4L)
R507  value 60.4  Tolerance: 1%  Case Code (Imperial): 0805  [RES-0805]  (hidden comment: RT0805FRE0760R4L)
U7  ATA6563-GBQW1  [Microchip VDFN8 pitch 0.65mm 3x3mm exposed pad 2.4x1.6mm]

### Ports
CAN_3V3 (harness CAN), CAN_PHY (harness CAN_PHY), STBY_3V3

### Harnesses
CAN: CAN_TX, CAN_RX
CAN_PHY: CANH, CANL

### Nets
+3V3: C62.2 U7.5(VIO)
+5V: C61.2 U7.3(VCC)
GND: C61.1 C62.1 C341.2 C342.2 C361.2 U7.2(GND) U7.9(GND_PAD)
PD0: U7.4(RXD) ; port CAN_3V3.CAN_RX
PD1: U7.1(TXD) ; port CAN_3V3.CAN_TX
PI11: U7.8(STBY) ; port STBY_3V3
NetC341_1: C341.1 R506.1 R507.2
NetC342_1: C342.1 R506.2 U7.7(CANH) ; port CAN_PHY.CANH
NetC361_1: C361.1 R507.1 U7.6(CANL) ; port CAN_PHY.CANL

### Layout directives
net class HIGH_CLEARANCE: NetC342_1, NetC361_1

### Notes on the sheet
- Title:
- ID:
- Date:
- Time:
- Version:
- Sheet
- of
- RevAuthor:
- Reference Designs ARE PROVIDED "AS IS" AND "WITH ALL FAULTS. Arduino SA DISCLAIMS ALL OTHER WARRANTIES, EXPRESS OR IMPLIED, REGARDING PRODUCTS, INCLUDING BUT NOT LIMITED TO, ANY IMPLIED WARRANTIES OF MERCHANTABILITY OR FITNESS FOR A PARTICULAR PURPOSE.
  Arduino SA may make changes to specifications and product descriptions at any time, without notice. The Customer must not rely on the absence or characteristics of any features or instructions marked "reserved" or "undefined".
  Arduino SA reserves these for future definition and shall have no responsibility whatsoever for conflicts or incompatibilities arising from future changes to them. The product information on the Web Site or Materials is subject to change without notice.
  Do not finalize a design with this info. ARDUINO and other Arduino brands and logos and Trademarks of Arduino SA. All Arduino SA Trademarks cannot be used without owner's formal permission.
- File:
- Author:

### Library data of the parts
C61 C62 = C0113-A.6: as C128-C131 on sheet WIFI_BLE; Technology: Ceramic; Part Number: CL03A104KP3NNNC; Dielectric: X5R; Tolerance: 10%
C341 = C0043-A.14: CAP CHIP 0603 100nF 10% 50V X7R; Manufacturer: Walsin; Code Arduino: 0015; Part Number: 0603B104K500CT; Part number 3: CL10B104KB8NNNC; Manufacturer 3: Samsung Electro-Mechanics; Part number 2: C1608B104K500NT; Dielectric: X7R; Tolerance: 10%; Manufacturer 2: Hottech; Technology: Ceramic
C342 C361 = C0117-A.6: CAP CHIP 0402 4.7pF ±0.5pF 50V C0G; Manufacturer: AVX; Code Arduino: C0117; Tolerance: 4.7%; Dielectric: C0G; Part Number: 04025A4R7DAT2A; Technology: Ceramic
R506 R507 = R0422-A.1: RES CHIP 0805 60R4 1% 1/8W 50ppm; Manufacturer: YAGEO; Code Arduino: R0422; Power: 125mW; Part Number: RT0805FRE0760R4L; Temperature coefficient: 50ppm; Technology: Thick film
U7 = U0505-A.4: IC CAN FD PHY 5Mbps, VIO pin, Standby, VDFN8 3x3mm; Manufacturer: Microchip; Code Arduino: U0505; Part Number: ATA6563-GBQW1